# EasyEDA schematic SCH_AIS-PBL-2.0_2025-09-11.json
TITLE: Sheet_1; REV: 1.0; Date: 2025-08-27; Sheet: 1/1; Drawn By: falhan; Company: Your Company
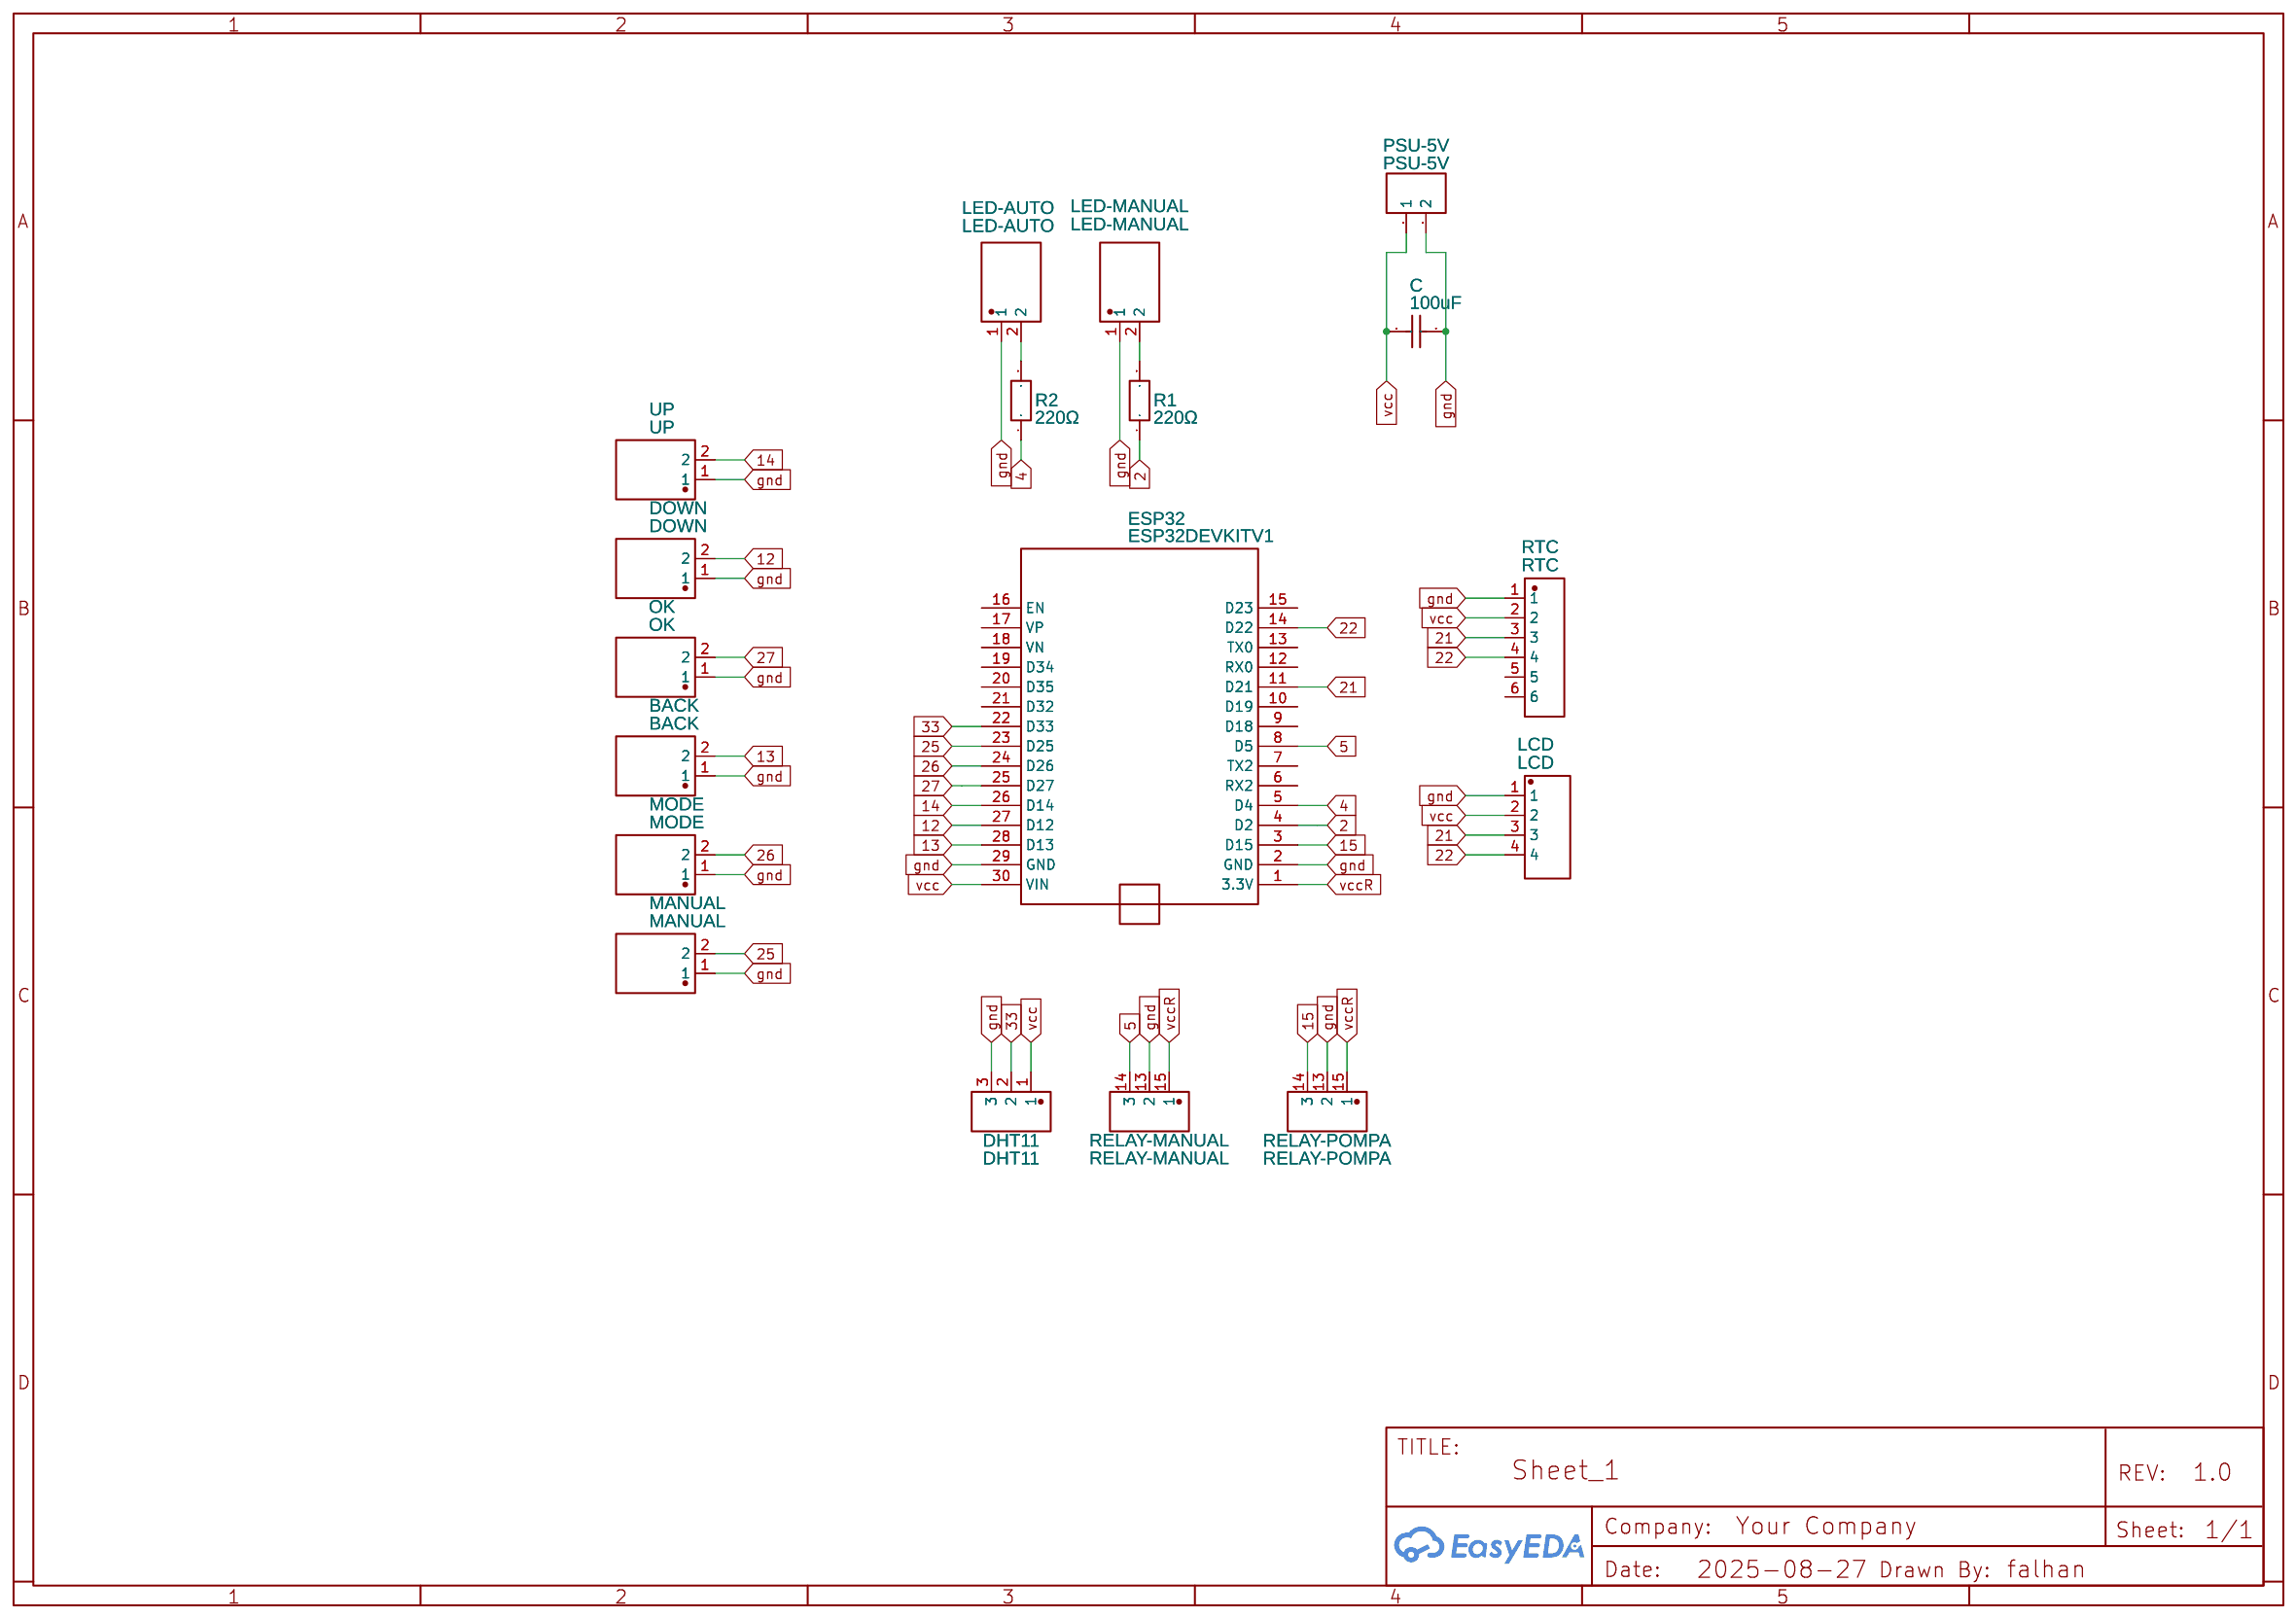
[diagram p0: schematic sheet]

## Parts
BACK  BACK  [CONN-TH_2P-P2.54_2501S-2P-SMALL]
C  100uF  [CAPACITOR, 5MM PIN CAPACITOR]
DHT11  DHT11  [CONN-TH_3P-P2.54_2501S-3P]
DOWN  DOWN  [CONN-TH_2P-P2.54_2501S-2P-SMALL]
ESP32  ESP32DEVKITV1  [ESP32DEVKITV1]
LCD  LCD  [CONN-TH_4P-P2.54_2501S-4P]
LED-AUTO  LED-AUTO  [CONN-TH_2P-P2.54_2501S-2P-SMALL]
LED-MANUAL  LED-MANUAL  [CONN-TH_2P-P2.54_2501S-2P-SMALL]
MANUAL  MANUAL  [CONN-TH_2P-P2.54_2501S-2P-SMALL]
MODE  MODE  [CONN-TH_2P-P2.54_2501S-2P-SMALL]
OK  OK  [CONN-TH_2P-P2.54_2501S-2P-SMALL]
PSU-5V  PSU-5V  [CONN-TH_2P-P5.00]
R1  220Ω  [RES-TH_BD2.4-L6.3-P10.30-D0.6]
R2  220Ω  [RES-TH_BD2.4-L6.3-P10.30-D0.6]
RELAY-MANUAL  RELAY-MANUAL  [RELAY MODULE 1 RELAYS]
RELAY-POMPA  RELAY-POMPA  [RELAY MODULE 1 RELAYS]
RTC  RTC  [HDR-TH_6P-P2.54-V-F]
UP  UP  [CONN-TH_2P-P2.54_2501S-2P-SMALL]

## Library data of the parts
BACK DOWN LED-AUTO LED-MANUAL MANUAL MODE OK UP = 2501S-2P_C168996: Contributor: 立创EDA官方封装库; Supplier: LCSC; Supplier Part: C168996; Manufacturer: Ckmtw(灿科盟); Manufacturer Part: W-2501S02P-K200; JLCPCB Part Class: Extended Part
C = 1nF ±20% 250V/AC Y2Capacitor: Supplier: LCSC; Manufacturer: ReliaPro; Supplier Part: C52215; Package Display: No
DHT11 = ZX-XH2.54-3PZZ: Contributor: lcsc; Supplier: LCSC; Supplier Part: C7429633; Manufacturer: Megastar(兆星); JLCPCB Part Class: Extended Part
ESP32 = ESP32DEVKITV1: Contributor: sreejeesh
LCD = 2501S-4P_C125328: Contributor: 立创EDA官方封装库; Supplier: LCSC; Manufacturer: Ckmtw(灿科盟); Manufacturer Part: W-2501S04P-K000; Supplier Part: C125328; JLCPCB Part Class: Extended Part
PSU-5V = CONN-TH_2P-P5.00: Supplier: LCSC; Contributor: LCEDA_Lib
R1 R2 = RN 1/4W 10K F T/B A1: Contributor: LCSC; Supplier: LCSC; Supplier Part: C410695; Manufacturer: Tyohm(幸亚电阻); Manufacturer Part: RN1/4W10KFT/BA1; JLCPCB Part Class: Extended Part
RELAY-MANUAL RELAY-POMPA = ZX-XH2.54-3PZZ: Contributor: lcsc; Supplier: LCSC; Supplier Part: C7429633; Manufacturer: Megastar(兆星); JLCPCB Part Class: Extended Part; Package Display: No
RTC = Header-Female-2.54_1x6: Supplier: LCSC; Manufacturer: BOOMELE(博穆精密); Manufacturer Part: 2.54-1*6P母; Supplier Part: C40877; JLCPCB Part Class: Extended Part

## Nets
gnd: BACK.1 C.2(1) DHT11.3 DOWN.1 ESP32.2(GND) ESP32.29(GND) LCD.1 LED-AUTO.1 LED-MANUAL.1 MANUAL.1 MODE.1 OK.1 PSU-5V.2 RELAY-MANUAL.13(2) RELAY-POMPA.13(2) RTC.1 UP.1
vcc: C.1(2) DHT11.1 ESP32.30(VIN) LCD.2 PSU-5V.1 RTC.2
vccR: ESP32.1(3.3V) RELAY-MANUAL.15(1) RELAY-POMPA.15(1)
2: ESP32.4(D2) R1.1
4: ESP32.5(D4) R2.1
5: ESP32.8(D5) RELAY-MANUAL.14(3)
12: DOWN.2 ESP32.27(D12)
13: BACK.2 ESP32.28(D13)
14: ESP32.26(D14) UP.2
15: ESP32.3(D15) RELAY-POMPA.14(3)
21: ESP32.11(D21) LCD.3 RTC.3
22: ESP32.14(D22) LCD.4 RTC.4
25: ESP32.23(D25) MANUAL.2
26: ESP32.24(D26) MODE.2
27: ESP32.25(D27) OK.2
33: DHT11.2 ESP32.22(D33)
Net-(LED-AUTO-2): LED-AUTO.2 R2.2
Net-(LED-MANUAL-2): LED-MANUAL.2 R1.2

Not connected (* = marked no-connect by the designer): ESP32 6(RX2) 7(TX2) 9(D18) 10(D19) 12(RX0) 13(TX0) 15(D23) 16(EN) 17(VP) 18(VN) 19(D34) 20(D35) 21(D32); RTC 5 6
